# EAGLE schematic AFM_piezo_controller2 (EAGLE 9.6.2)
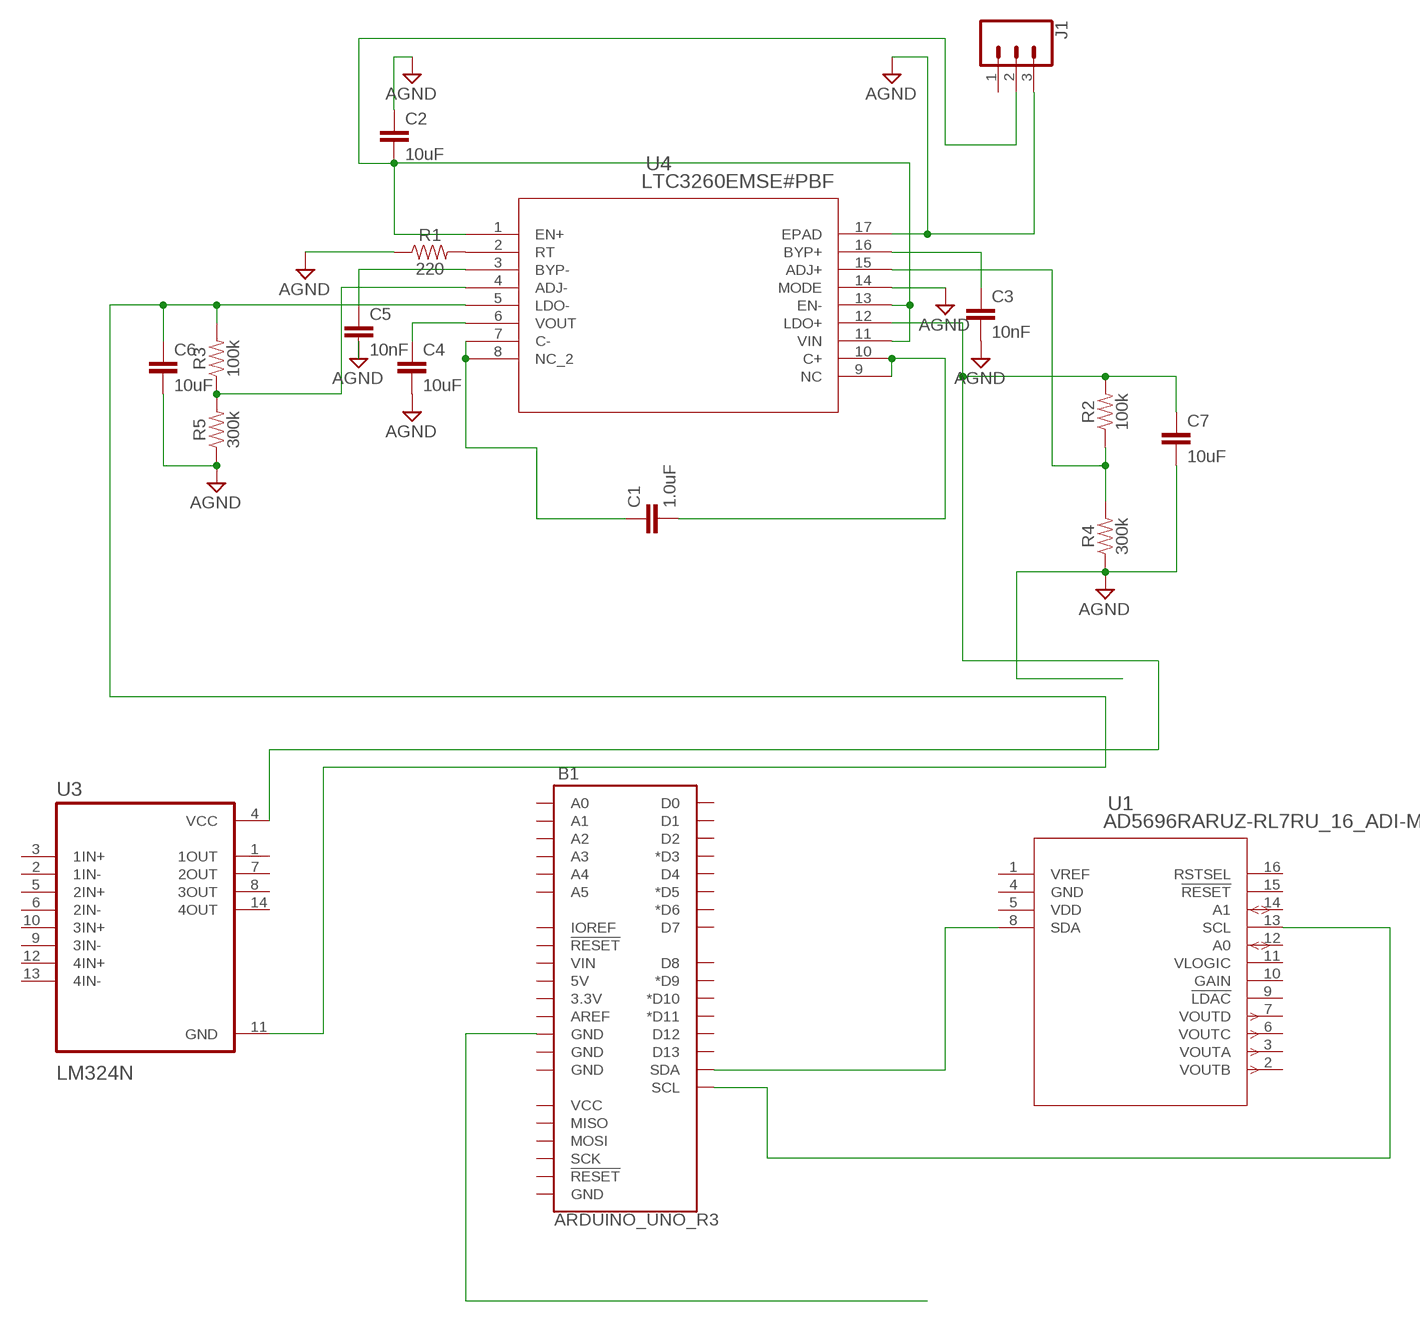
[diagram p0: schematic, sheet 1]

## Parts
B1  ARDUINO_UNO_R3  [ARDUINO_R3]
C1  1.0uF  1.0UF-0805-25V-(+80/-20%)  [0805]
C2  10uF  10UF-0805-25V-10%  [0805]
C3  10nF  10NF-0603-50V-10%  [0603]
C4  10uF  10UF-0805-25V-10%  [0805]
C5  10nF  10NF-0603-50V-10%  [0603]
C6  10uF  10UF-0805-25V-10%  [0805]
C7  10uF  10UF-0805-25V-10%  [0805]
J1  CONN_03LONGPADS  [1X03_LONGPADS]
R1  220  220OHM-0603-1/10W-1%  [0603]
R2  100k  100KOHM-0603-1/10W-1%  [0603]
R3  100k  100KOHM-0603-1/10W-1%  [0603]
R4  300k  300KOHM-0603-1/10W-1%  [0603]
R5  300k  300KOHM-0603-1/10W-1%  [0603]
U1  AD5696RARUZ-RL7RU_16_ADI-M  [RU_16_ADI-M]
U3  LM324N  [DIP794W45P254L1969H508Q14]
U4  LTC3260EMSE#PBF  [MSOP-16_MSE]

## Nets
AGND: C2.1 C3.2 C4.2 C5.2 C6.2 C7.2 J1.3 R1.1 R4.1 R5.1 U4.14(MODE) U4.17(EPAD)
N$1: C5.1 U4.3(BYP-)
N$2: R1.2 U4.2(RT)
N$3: C1.1 U4.7(C-) U4.8(NC_2)
N$4: C1.2 U4.9(NC) U4.10(C+)
N$5: C2.2 J1.2 U4.1(EN+) U4.11(VIN) U4.13(EN-)
N$6: C3.1 U4.16(BYP+)
N$7: C4.1 U4.6(VOUT)
N$8: R3.1 R5.2 U4.4(ADJ-)
N$9: B1.SDA U1.8(SDA)
N$10: C6.1 R3.2 U3.11(GND) U4.5(LDO-)
N$11: B1.SCL U1.13(SCL)
N$12: R2.1 R4.2 U4.15(ADJ+)
N$13: C7.1 R2.2 U3.4(VCC) U4.12(LDO+)
N$15: B1.GND@4(GND)
Unconnected: B1.3.3V B1.5V B1.A0 B1.A1 B1.A2 B1.A3 B1.A4 B1.A5 B1.AREF B1.D0 B1.D1 B1.D2 B1.D3(*D3) B1.D4 B1.D5(*D5) B1.D6(*D6) B1.D7 B1.D8 B1.D9(*D9) B1.D10(*D10) B1.D11(*D11) B1.D12 B1.D13 B1.GND@1(GND) B1.GND@2(GND) B1.GND@3(GND) B1.IOREF B1.MISO B1.MOSI B1.RESET@1(!RESET!) B1.RESET@2(!RESET!) B1.SCK B1.VCC B1.VIN J1.1 U1.2(VOUTB) U1.3(VOUTA) U1.4(GND) U1.6(VOUTC) U1.7(VOUTD) U1.9(!LDAC) U1.10(GAIN) U1.12(A0) U1.14(A1) U1.15(!RESET) U1.16(RSTSEL) U3.1(1OUT) U3.2(1IN-) U3.3(1IN+) U3.5(2IN+) U3.6(2IN-) U3.7(2OUT) U3.8(3OUT) U3.9(3IN-) U3.10(3IN+) U3.12(4IN+) U3.13(4IN-) U3.14(4OUT)

## Power pins joined to a net without a drawn wire
VDD: U1.5(VDD)
VLOGIC: U1.11(VLOGIC)
VREF: U1.1(VREF)

## Library data of the parts
B1 = SparkFun-Boards:ARDUINO_UNO_R3: Arduino R3 Footprint with SPI header Arduino Uno R3 Compatible Footprint. Matches PCB size of the original board. SparkFun Products: SAMD21 Dev Breakout <https://www.sparkfun.com/products/13672> RedBoard <https://www.sparkfun.com/products/12757> R3 Stackable Headers <https://www.sparkfun.com/products/11417>
C1 = SparkFun-Capacitors:1.0UF: 1µF ceramic capacitors A capacitor is a passive two-terminal electrical component used to store electrical energy temporarily in an electric field.; PROD_ID: CAP-11625
C2 C4 C6 C7 = SparkFun-Capacitors:10UF: 10.0µF ceramic capacitors A capacitor is a passive two-terminal electrical component used to store electrical energy temporarily in an electric field.; PROD_ID: CAP-14259
C3 C5 = SparkFun-Capacitors:10NF: 0.01uF/10nF/10,000pF ceramic capacitors A capacitor is a passive two-terminal electrical component used to store electrical energy temporarily in an electric field. CAP-09321; PROD_ID: CAP-00867
J1 = SparkFun-Connectors:CONN_03: Multi connection point. Often used as Generic Header-pin footprint for 0.1 inch spaced/style header connections On any of the 0.1 inch spaced packages, you can populate with these: Break Away Headers - Straight <https://www.sparkfun.com/products/116> (PRT-00116) Break Away Male Headers - Right Angle <https://www.sparkfun.com/products/553> (PRT-00553) Female Headers <https://www.sparkfun.com/products/115> (PRT-00115) Break Away Headers - Machine Pin <https://www.sparkfun.com/products/117> (PRT-00117) Break Away Female Headers - Swiss Machine Pin <https://www.sparkfun.com/products/743> (PRT-00743) Stackable Header - 3 Pin (Female, 0.1") <https://www.sparkfun.com/products/13875> (PRT-13875) For SCREWTERMINALS and SPRING TERMINALS visit here: Screw Terimnals on SparkFun.com <https://www.sparkfun.com/search/results?term=Screw+Terminals> (5mm/3.5mm/2.54mm spacing) This device is also useful as a general connection point to wire up your design to another part of your project. Our various solder wires solder well into these plated through hole pads. Hook-Up Wire - Assortment (Stranded, 22 AWG) <https://www.sparkfun.com/products/11375> (PRT-11375) Hook-Up Wire - Assortment (Solid Core, 22 AWG) <https://www.sparkfun.com/products/11367> (PRT-11367) View the entire wire category on our website here <https://www.sparkfun.com/categories/141> Special notes: Molex polarized connector foot print use with SKU : PRT-08232 with associated crimp pins and housings.
R1 = SparkFun-Resistors:220OHM: 220Ω resistor A resistor is a passive two-terminal electrical component that implements electrical resistance as a circuit element. Resistors act to reduce current flow, and, at the same time, act to lower voltage levels within circuits. - Wikipedia; PROD_ID: RES-07861
R2 R3 = SparkFun-Resistors:100KOHM: 100kΩ resistor A resistor is a passive two-terminal electrical component that implements electrical resistance as a circuit element. Resistors act to reduce current flow, and, at the same time, act to lower voltage levels within circuits. - Wikipedia; PROD_ID: RES-07828
R4 R5 = SparkFun-Resistors:300KOHM: 300kΩ resistor A resistor is a passive two-terminal electrical component that implements electrical resistance as a circuit element. Resistors act to reduce current flow, and, at the same time, act to lower voltage levels within circuits. - Wikipedia; PROD_ID: RES-10809
U1 = AD5696:AD5696RARUZ-RL7; COPYRIGHT: Copyright (C) 2024 Ultra Librarian. All rights reserved.; MANUFACTURER_PART_NUMBER: AD5696RARUZ-RL7; MFR_NAME: Analog Devices Inc
U3 = LM324N:LM324N: Check availability <https://pricing.snapeda.com/parts/LM324N/ON%20Semiconductor%20/%20Fairchild/view-part?ref=eda>; AVAILABILITY: In Stock; CHECK_PRICES: https://www.snapeda.com/parts/LM324N/Fairchild+Semiconductor/view-part/?ref=eda; DESCRIPTION: General Purpose Amplifier 4 Circuit 14-MDIP; MF: ON Semiconductor / Fairchild; MP: LM324N; PACKAGE: None; PRICE: None; SNAPEDA_LINK: https://www.snapeda.com/parts/LM324N/Fairchild+Semiconductor/view-part/?ref=snap
U4 = LTC3260EMSE_PBF (1):LTC3260EMSE#PBF: Check availability <https://pricing.snapeda.com/parts/LTC3260EMSE%23PBF/Analog%20Devices/view-part?ref=eda>; AVAILABILITY: In Stock; CHECK_PRICES: https://www.snapeda.com/parts/LTC3260EMSE%23PBF/Analog+Devices/view-part/?ref=eda; DESCRIPTION: Low Noise Dual Supply Inverting Charge Pump; MF: Analog Devices; MP: LTC3260EMSE#PBF; PACKAGE: MSOP -16 Analog Devices; PRICE: None; PURCHASE-URL: https://www.snapeda.com/api/url_track_click_mouser/?unipart_id=4339513&manufacturer=Analog Devices&part_name=LTC3260EMSE#PBF&search_term=None; SNAPEDA_LINK: https://www.snapeda.com/parts/LTC3260EMSE%23PBF/Analog+Devices/view-part/?ref=snap